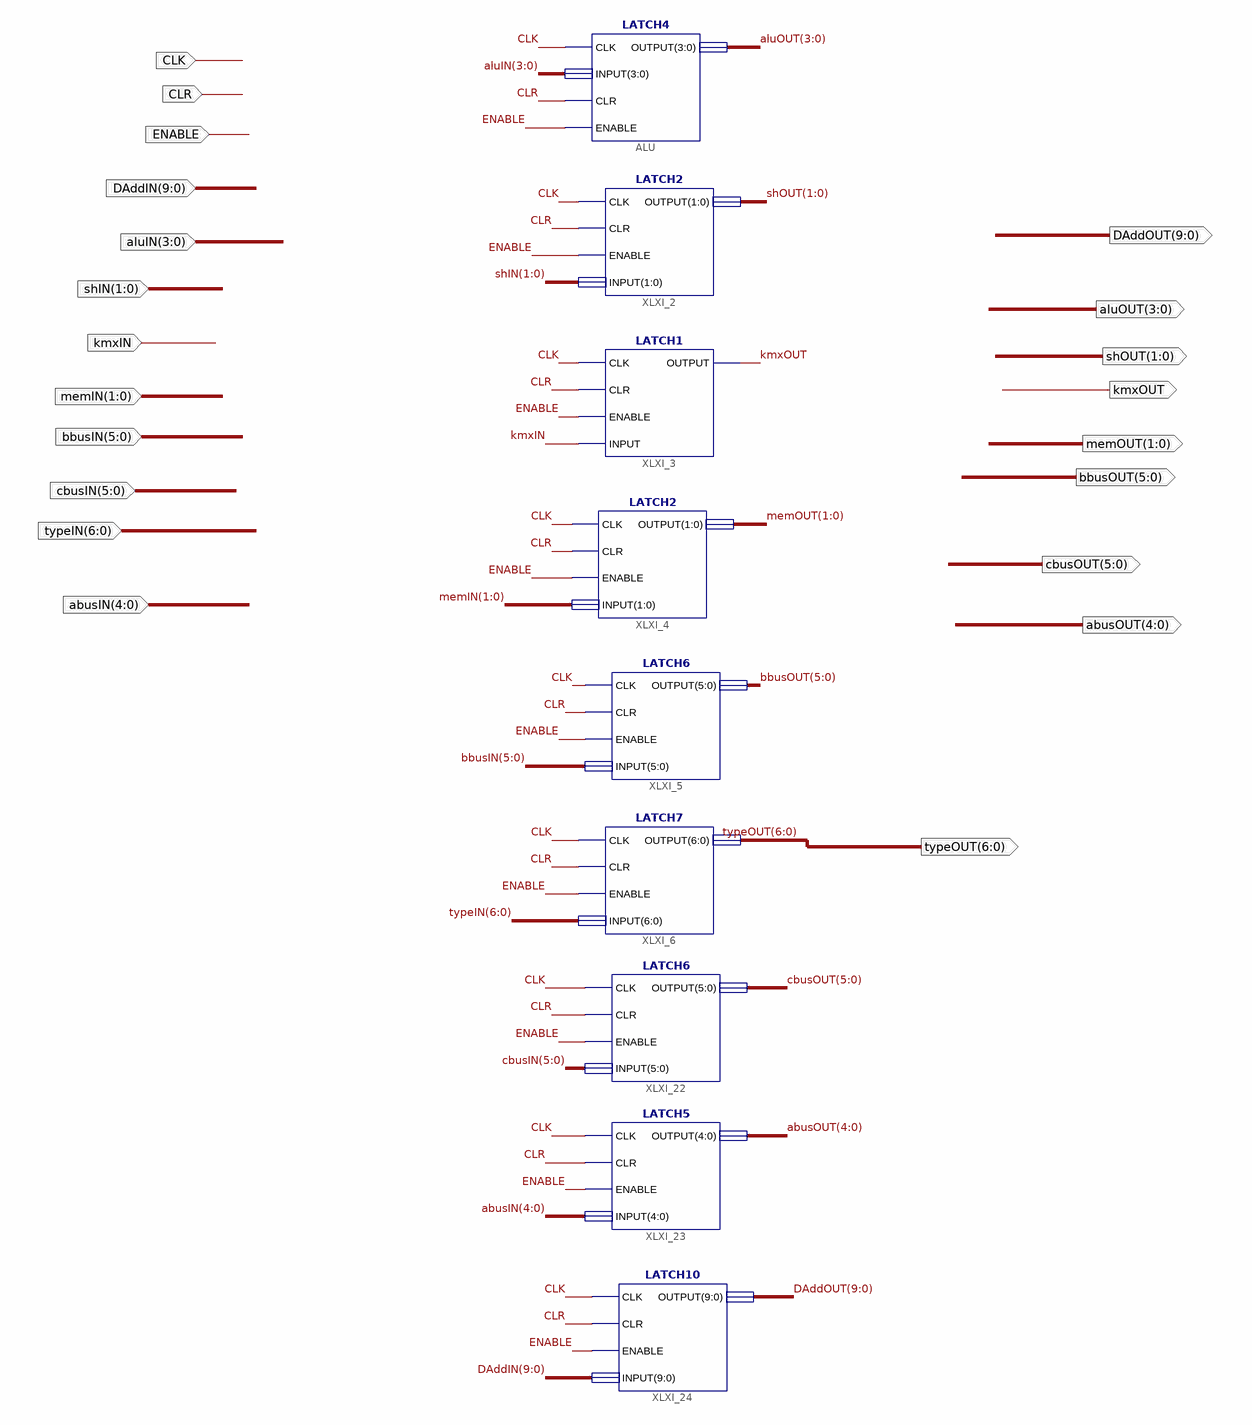
[diagram p0: schematic sheet 1]
// Xilinx ISE schematic toOperand.sch (artix7) as structural Verilog: 9 symbols, 21 ports
module toOperand (
  input  CLK,
  input  CLR,
  input  ENABLE,
  input  [9:0] DAddIN,
  input  [3:0] aluIN,
  input  [1:0] shIN,
  input  [1:0] memIN,
  input  [5:0] bbusIN,
  input  [5:0] cbusIN,
  input  [6:0] typeIN,
  input  [4:0] abusIN,
  input  kmxIN,
  output [9:0] DAddOUT,
  output [3:0] aluOUT,
  output kmxOUT,
  output [1:0] memOUT,
  output [6:0] typeOUT,
  output [5:0] bbusOUT,
  output [1:0] shOUT,
  output [5:0] cbusOUT,
  output [4:0] abusOUT
);

  LATCH4 ALU (.CLK(CLK), .INPUT(aluIN), .CLR(CLR), .ENABLE(ENABLE), .OUTPUT(aluOUT));
  LATCH7 XLXI_6 (.CLK(CLK), .CLR(CLR), .ENABLE(ENABLE), .INPUT(typeIN), .OUTPUT(typeOUT));
  LATCH6 XLXI_5 (.CLK(CLK), .CLR(CLR), .ENABLE(ENABLE), .INPUT(bbusIN), .OUTPUT(bbusOUT));
  LATCH2 XLXI_4 (.CLK(CLK), .CLR(CLR), .ENABLE(ENABLE), .INPUT(memIN), .OUTPUT(memOUT));
  LATCH1 XLXI_3 (.CLK(CLK), .CLR(CLR), .ENABLE(ENABLE), .INPUT(kmxIN), .OUTPUT(kmxOUT));
  LATCH2 XLXI_2 (.CLK(CLK), .CLR(CLR), .ENABLE(ENABLE), .INPUT(shIN), .OUTPUT(shOUT));
  LATCH6 XLXI_22 (.CLK(CLK), .CLR(CLR), .ENABLE(ENABLE), .INPUT(cbusIN), .OUTPUT(cbusOUT));
  LATCH5 XLXI_23 (.CLK(CLK), .CLR(CLR), .ENABLE(ENABLE), .INPUT(abusIN), .OUTPUT(abusOUT));
  LATCH10 XLXI_24 (.CLK(CLK), .CLR(CLR), .ENABLE(ENABLE), .INPUT(DAddIN), .OUTPUT(DAddOUT));
endmodule
